# Altium schematic sheet TOP.SchDoc
size A; SheetNumber: 1; SheetTotal: 1
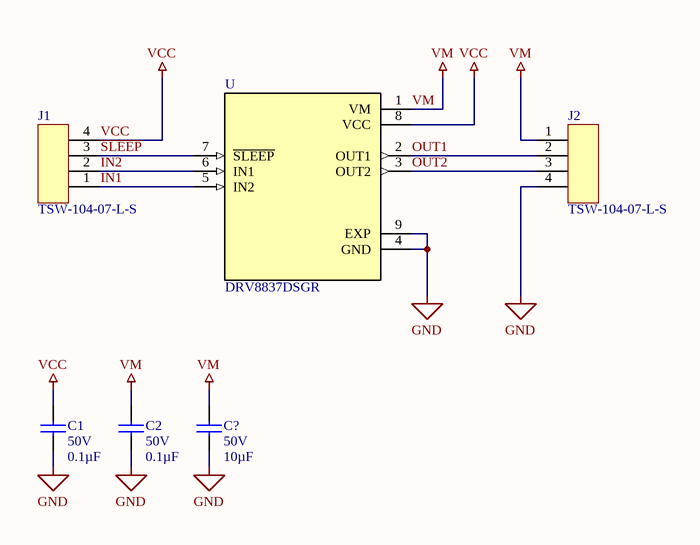
[diagram p0: TOP.SchDoc]

## Parts
C1  Voltage Rating: 50V  Capacitance: 0.1µF  [CAPC0805L]  (hidden comment: C0805C104J5RACTU)
C2  Voltage Rating: 50V  Capacitance: 0.1µF  [CAPC0805L]  (hidden comment: C0805C104J5RACTU)
C?  Voltage Rating: 50V  Capacitance: 10µF  [CAPC1210L]
J1  TSW-104-07-L-S  [TSW-104-07-L-S]
J2  TSW-104-07-L-S  [TSW-104-07-L-S]
U  DRV8837DSGR  [SON50P200X200X80-9N]

## Nets
GND: C1.1 C2.1 C?.2 J2.4 U.4(GND) U.9(EXP)
VCC: C1.2 J1.4 U.8(VCC)
VM: C2.2 C?.1 J2.1 U.1(VM)
IN1: J1.1 U.5(IN2)
IN2: J1.2 U.6(IN1)
OUT1: J2.2 U.2(OUT1)
OUT2: J2.3 U.3(OUT2)
~{SLEEP}: J1.3 U.7(~{SLEEP})

## Library data of the parts
C1 C2 = CMPL-001-A884-A.2: 0.1µF ±5% 50V Ceramic Capacitor X7R 0805 (2012 Metric); Manufacturer: KEMET; Applications: Bypass, Decoupling; Package: 0805; Operating Temperature: -55°C ~ 125°C; Tolerance: ±5%; Manufacturer Part Number: C0805C104J5RACTU; Supplier 1 Part Number: 399-1171-1-ND; Temperature Coefficient: X7R; Supplier 1: Digikey
C? = CMPL-001-A044-A.4: 10µF 50V Ceramic Capacitor X7R 1210 (3225 Metric) 0.126" L x 0.098" W (3.20mm x 2.50mm); Manufacturer: Murata Electronics North America; Manufacturer Part Number: GRM32ER71H106KA12L; FUTEK Item #: GOD05133; Tolerance: ±10%; Temperature Coefficient: X7R; Supplier 1 Part Number: 490-6544-1-ND; Package: 1210; Operating Temperature: -55°C ~ 125°C; Applications: General Purpose; Supplier 1: Digikey
J1 J2 = CMPL-001-B545-A.2: CONN HEADER VERT 4POS 2.54MM; Manufacturer: Samtec Inc.; Pitch: 0.100" (2.54mm); Number of Positions: 4; Number of Positions Loaded: All; Connector Type: Male Pin; Contact Type: Male Pin; Manufacturer Part Number: TSW-104-07-L-S; Number of Rows: 1; Contact Finish Thickness: 10.0µin (0.25µm); Mounting Type: Through Hole; RoHS Compliance: Yes; Color: Black; Supplier 1: Digikey; Contact Finish: Gold; Termination: Solder; Supplier 1 Part Number: SAM1031-04-ND; Row Spacing: -
U = CMP-002-000000-2: 11-V, 1.8-A H-bridge motor driver 8-WSON -40 to 85; MF: Texas Instruments; SnapEDA_Link: https://www.snapeda.com/parts/DRV8837DSGR/Texas%20Instruments/view-part/230051/?ref=snap; Component Type: Standard; BuyPart: https://www.snapeda.com/parts/DRV8837DSGR/Texas%20Instruments/view-part/230051/?ref=eda; Pin Count: 9; Source: DRV8837DSGR.SchLib; Arrow_Electronics-Purchase-URL: https://snapeda.com/shop?store=Arrow+Electronics&id=230051; Texas_Instruments-Purchase-URL: https://snapeda.com/shop?store=Texas+Instruments&id=230051; Design Item ID: DRV8837DSGR; DigiKey-Purchase-URL: https://snapeda.com/shop?store=DigiKey&id=230051; Value: *; MP: DRV8837DSGR; Package: WSON-8 Texas Instruments; Mouser-Purchase-URL: https://snapeda.com/shop?store=Mouser&id=230051; Digi-Key_Part_Number: 296-34806-1-ND